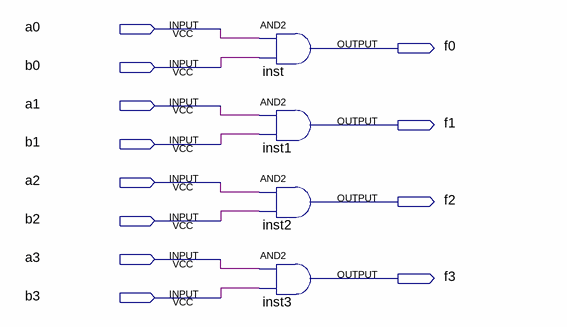
[diagram p0: schematic sheet]
// Quartus schematic palu_bool_logic_unit.bdf as structural Verilog: 4 symbols, 12 pins
module palu_bool_logic_unit (
  input  a0,
  input  b0,
  input  a1,
  input  b1,
  input  a2,
  input  b2,
  input  a3,
  input  b3,
  output f0,
  output f1,
  output f2,
  output f3
);

  and inst (f0, a0, b0);
  and inst1 (f1, a1, b1);
  and inst2 (f2, a2, b2);
  and inst3 (f3, a3, b3);
endmodule
